# EAGLE design Stick (EAGLE 7.1.0)
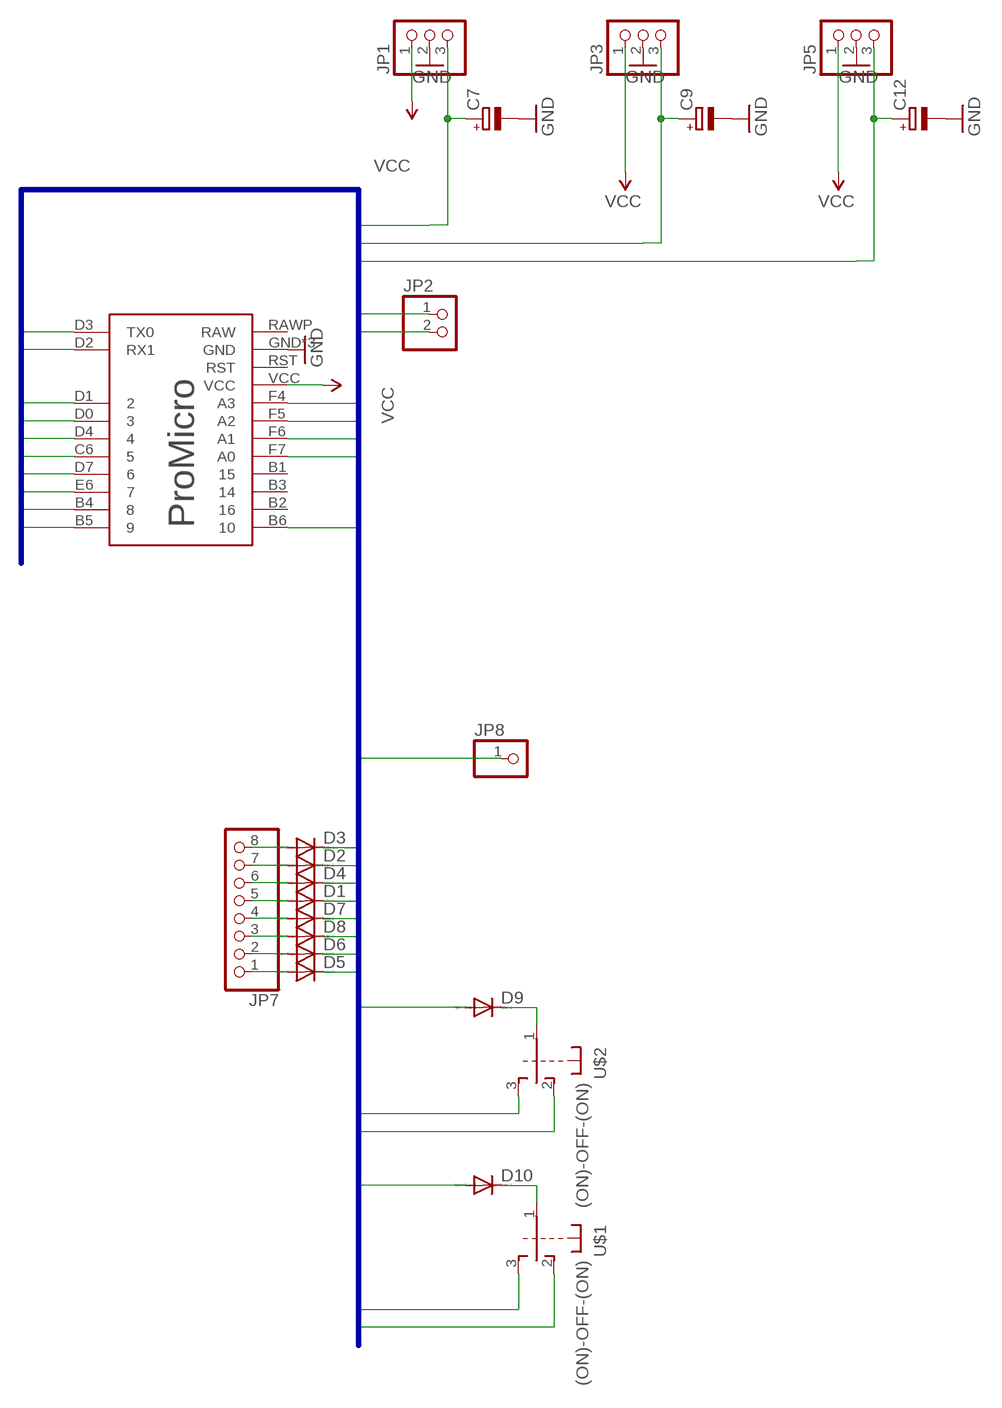
[diagram p0: schematic, sheet 1]

## Parts
C7  CPOL-EUE2.5-5  [E2,5-5]
C9  CPOL-EUE2.5-5  [E2,5-5]
C12  CPOL-EUE2.5-5  [E2,5-5]
D1  DIODE-MINIMELF  [MINIMELF]
D2  DIODE-MINIMELF  [MINIMELF]
D3  DIODE-MINIMELF  [MINIMELF]
D4  DIODE-MINIMELF  [MINIMELF]
D5  DIODE-MINIMELF  [MINIMELF]
D6  DIODE-MINIMELF  [MINIMELF]
D7  DIODE-MINIMELF  [MINIMELF]
D8  DIODE-MINIMELF  [MINIMELF]
D9  DIODE-MINIMELF  [MINIMELF]
D10  DIODE-MINIMELF  [MINIMELF]
JP1  PINHD-1X3  [1X03]
JP2  PINHD-1X2  [1X02]
JP3  PINHD-1X3  [1X03]
JP5  PINHD-1X3  [1X03]
JP7  PINHD-1X8  [1X08]
JP8  PINHD-1X1  [1X01]
U$1  (ON)-OFF-(ON)  [SWITCH-(ON)-OFF-(ON)]
U$2  (ON)-OFF-(ON)  [SWITCH-(ON)-OFF-(ON)]
U$3  SPARKFUN  [PRO-MICRO]

## Nets
A1: C7.+ JP1.3 U$3.F4(A3)
A2: C9.+ JP3.3 U$3.F5(A2)
A3: C12.+ JP5.3 U$3.F6(A1)
A4: JP2.1 U$3.F7(A0)
A5: JP2.2 U$3.B6
C1: JP8.1 U$3.D2(RX1)
C2: D9.A D10.A U$3.D3(TX0)
GND [vcc]: C7.- C9.- C12.- JP1.2 JP3.2 JP5.2 U$3.GND U$3.GND3(GND) U$3.GND4(GND)
N$13: D9.C U$2.1
N$14: D10.C U$1.1
N$21: D8.A JP7.3
N$22: D7.A JP7.4
N$23: D6.A JP7.2
N$24: D5.A JP7.1
N$25: D4.A JP7.6
N$26: D3.A JP7.8
N$27: D2.A JP7.7
N$28: D1.A JP7.5
R1: D5.C U$3.D1
R2: D6.C U$2.2 U$3.D0
R3: D8.C U$2.3 U$3.D4
R4: D7.C U$1.2 U$3.C6
R5: D1.C U$1.3 U$3.D7
R6: D4.C U$3.E6
R7: D2.C U$3.B4
R8: D3.C U$3.B5
VCC: JP1.1 JP3.1 JP5.1 U$3.VCC
Unconnected: U$3.B1 U$3.B2 U$3.B3 U$3.RAWP(RAW) U$3.RST

## Buses
R1,R2,R3,R4,R5,R6,R7,R8,C1,C2,A1,A2,A3,A4,A5

## Library data of the parts
C7 C9 C12 = rcl:CPOL-EU: POLARIZED CAPACITOR, European symbol
D1-D10 = diode:DIODE-: DIODE
JP1 JP3 JP5 = pinhead:PINHD-1X3: PIN HEADER
JP2 = pinhead:PINHD-1X2: PIN HEADER
JP7 = pinhead:PINHD-1X8: PIN HEADER
JP8 = pinhead:PINHD-1X1: PIN HEADER
U$1 U$2 = Namenlos:(ON)-OFF-(ON)
U$3 = SparkFun:SPARKFUN

## Net classes
0 default: width 0.203 mm

## Board
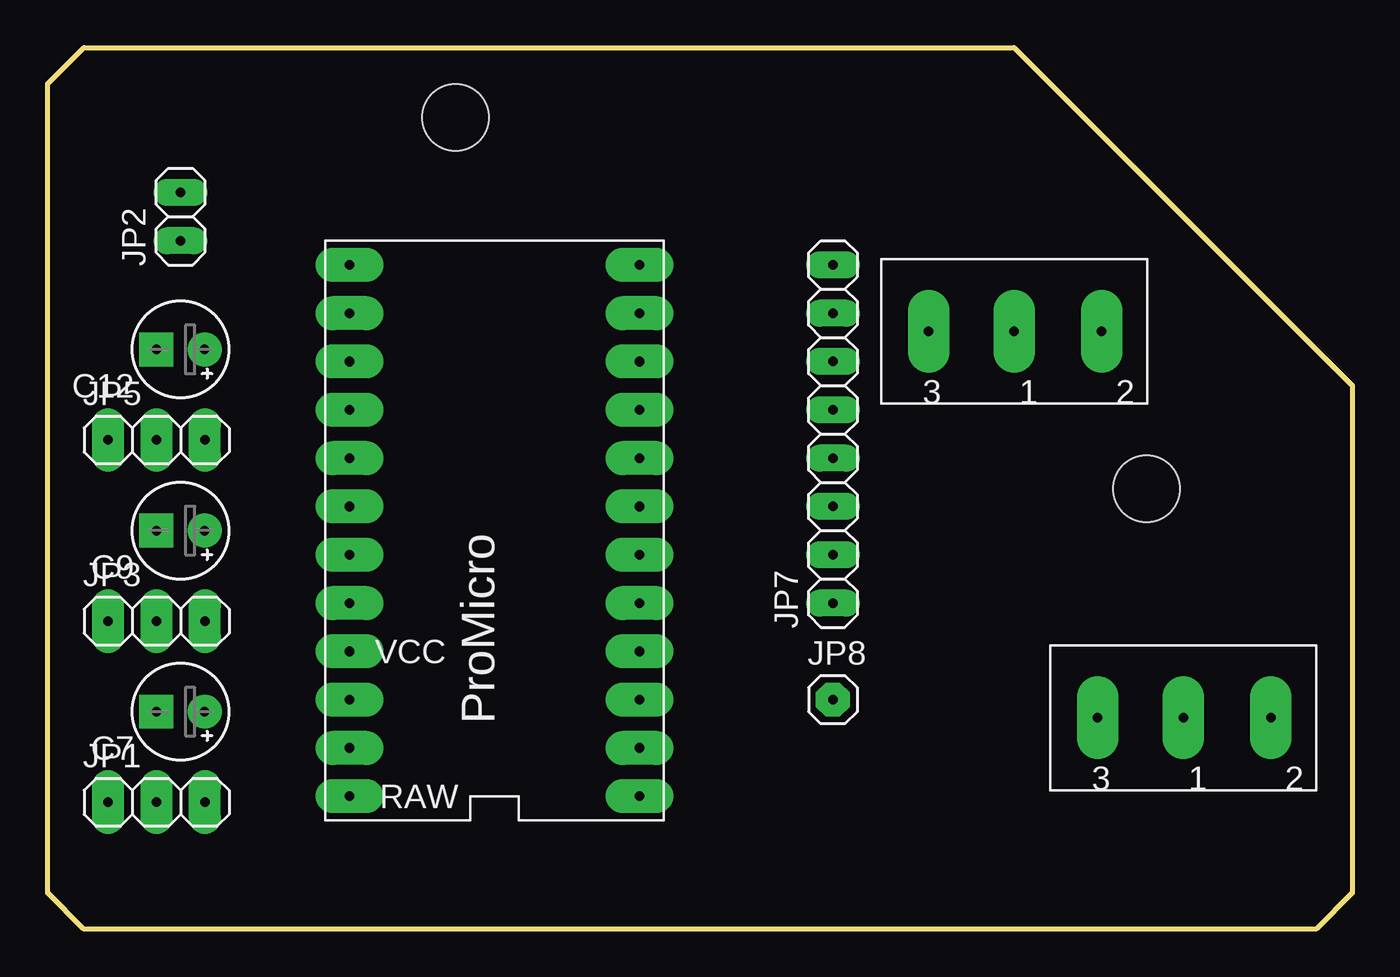
[diagram p1: board, top side]
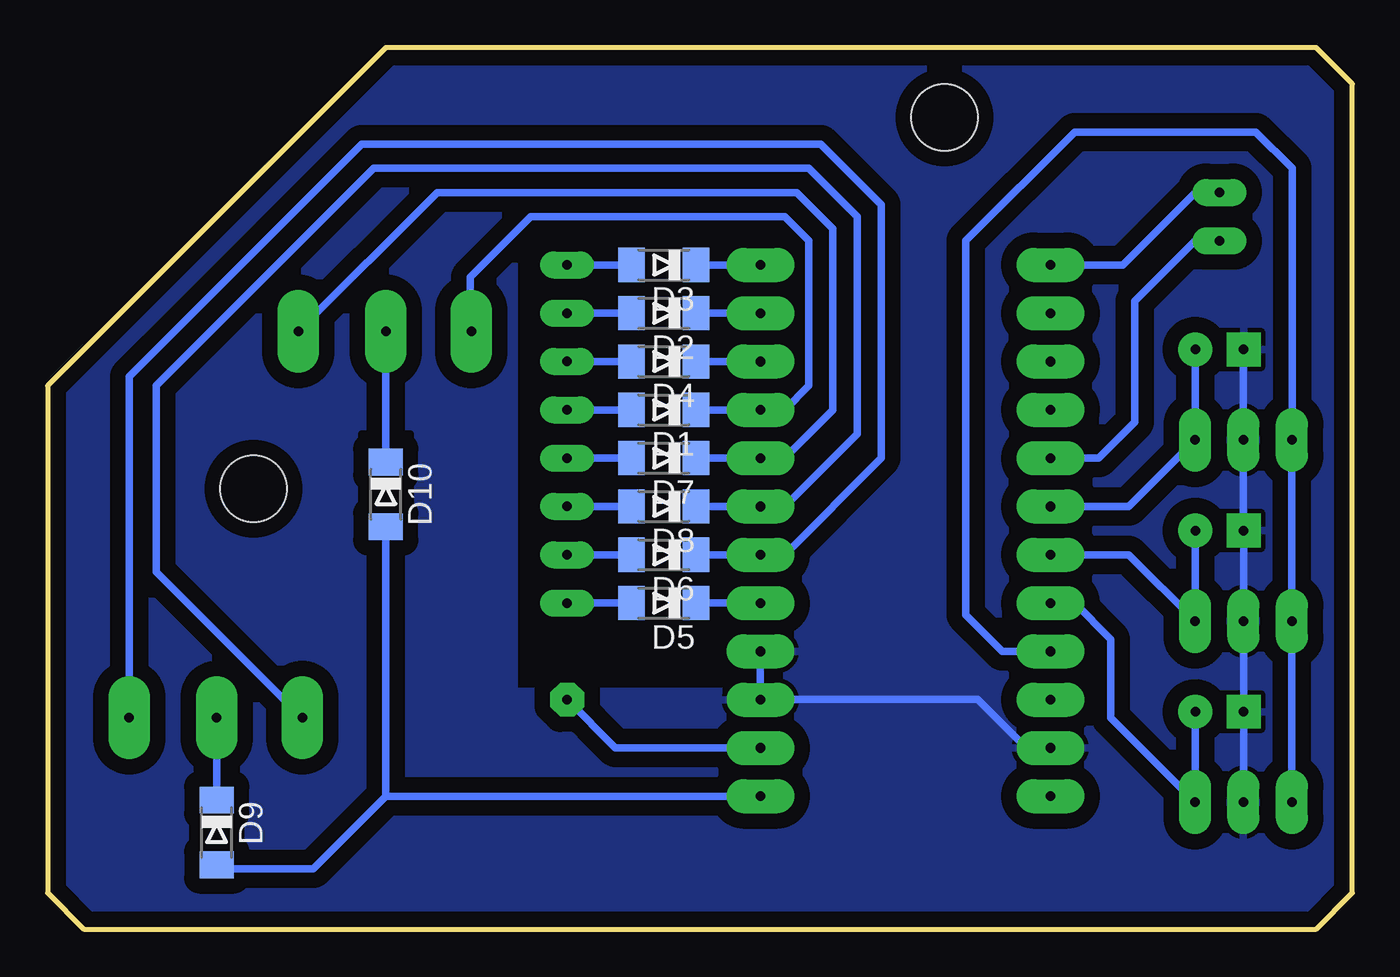
[diagram p2: board, bottom side, seen from below]

Size 68.58 x 46.35 mm. Coordinates in mm from the lower left corner, seen from the top.
Outline: 0,44.45 1.91,46.35 50.8,46.35 68.58,28.57 68.58,1.9 66.67,0 1.91,0 0,1.9 0,44.45
Copper layers (1*16): Top 0.035mm / dielectric 1.5mm / Bottom 0.035mm
Design rules "SparkFun *": minimum track width 8mil, minimum drill 15mil, track to track 7mil, track to pad 7mil, pad to pad 7mil, via to via 7mil, smd to smd 7mil, copper to edge 7mil, drill to drill 7mil, minimum pad ring 12mil, minimum via ring 10mil, stop-mask expansion 4mil, vias tented up to drill 20mil, thermal gap 10mil
Holes 3.5 mm at 57.75,23.16 21.45,42.69
tRestrict: area -22.6,8.3 to -22.4,8.4; area -18.7,12.3 to -18.6,12.4; area -26.3,9 to -19.2,16.3

### Footprints (pad centres in the part's own frame; a part is rotated, then mirrored left to right if it is on the bottom)
E2,5-5 = drill 0.5 pad 1.778: + -1.27,0 | drill 0.5 pad 1.778 square: - 1.27,0
MINIMELF = smd 1.4 x 1.8: A 1.7,0; C -1.7,0
1X03 = drill 0.5 pad 1.676 long: 1 -2.54,0; 2 0,0; 3 2.54,0
1X02 = drill 0.5 pad 1.422 long: 1 -1.27,0; 2 1.27,0
1X08 = drill 0.5 pad 1.422 long: 1 -8.89,0; 2 -6.35,0; 3 -3.81,0; 4 -1.27,0; 5 1.27,0; 6 3.81,0; 7 6.35,0; 8 8.89,0
1X01 = drill 0.5 pad 1.778 octagon: 1 0,0
SWITCH-(ON)-OFF-(ON) = drill 0.5 pad 2.184 long: 1 0,0; 2 -4.6,0; 3 4.5,0
PRO-MICRO = drill 0.508 pad 1.778 long: B1 7.62,7.62; B2 12.7,7.62; B3 10.16,7.62; B4 12.7,-7.62; B5 15.24,-7.62; B6 15.24,7.62; C6 5.08,-7.62; D0 0,-7.62; D1 -2.54,-7.62; D2 -10.16,-7.62; D3 -12.7,-7.62; D4 2.54,-7.62; D7 7.62,-7.62; E6 10.16,-7.62; F4 -2.54,7.62; F5 0,7.62; F6 2.54,7.62; F7 5.08,7.62; GND -10.16,7.62; GND3 -7.62,-7.62; GND4 -5.08,-7.62; RAWP -12.7,7.62; RST -7.62,7.62; VCC -5.08,7.62

### Placement (x,y rotation side)
C7  6.98,11.43 180 top
C9  6.98,20.96 180 top
C12  6.98,30.48 180 top
D1  36.19,27.3 180 bottom
D2  36.19,32.38 180 bottom
D3  36.19,34.92 180 bottom
D4  36.19,29.84 180 bottom
D5  36.19,17.14 180 bottom
D6  36.19,19.68 180 bottom
D7  36.19,24.77 180 bottom
D8  36.19,22.23 180 bottom
D9  59.69,5.08 270 bottom
D10  50.8,22.86 270 bottom
JP1  5.73,6.67 0 top
JP2  6.98,37.46 90 top
JP3  5.73,16.19 0 top
JP5  5.73,25.72 0 top
JP7  41.28,26.04 90 top
JP8  41.28,12.07 0 top
U$1  50.8,31.43 180 top
U$2  59.69,11.11 180 top
U$3  23.49,19.68 90 top

### Tracks (layer width: path | path; a pad name or v marks a point on that pad's centre or on a via)
A1
  Bottom 0.406: U$3.F4 14.6,17.14 12.7,15.24 12.7,11.1 JP1.3 8.27,11.42 C7.+
A2
  Bottom 0.406: C9.+ 8.26,16.21 JP3.3 11.76,19.68 U$3.F5
A3
  Bottom 0.406: C12.+ 8.26,25.73 JP5.3 11.76,22.23 U$3.F6
A4
  Bottom 0.406: U$3.F7 13.34,24.77 11.43,26.67 11.43,33.02 8.26,36.2 JP2.1
A5
  Bottom 0.406: U$3.B6 12.06,34.92 8.26,38.73 JP2.2
C1
  Bottom 0.406: U$3.D2 38.73,9.53 JP8.1
C2
  Bottom 0.406: 50.8,6.99 54.61,3.18 59.48,3.18 D9.A | D10.A 50.8,6.99 | U$3.D3 50.8,6.99
GND
  Bottom 0.406: U$3.GND4 U$3.GND3 19.69,12.07 17.15,9.53 U$3.GND | JP1.2 5.72,6.68 C7.- 5.72,16.51 5.73,16.5 JP3.2 5.72,16.21 C9.- 5.73,20.97 JP5.2 5.73,30.47 C12.-
  pour Bottom (isolate 0.813): 0.63,45.72 50.17,45.72 67.94,27.94 67.94,0.64 0.63,0.64
N$1
  cutout Bottom (isolate 0.813): 32.39,36.83 32.39,12.7 43.81,12.7 43.81,36.83
N$2
  cutout Bottom (isolate 0.813): 49.53,26.04 49.53,20.32 52.07,20.32 52.07,26.04
N$4
  cutout Bottom (isolate 0.813): 58.42,6.99 58.42,3.18 60.96,3.18 60.96,6.99
N$13
  Bottom 0.406: D9.C U$2.1
N$14
  Bottom 0.406: D10.C 50.8,28.26 U$1.1
N$21
  Bottom 0.406: D8.A JP7.3
N$22
  Bottom 0.406: D7.A JP7.4
N$23
  Bottom 0.406: D6.A JP7.2
N$24
  Bottom 0.406: D5.A JP7.1
N$25
  Bottom 0.406: D4.A JP7.6
N$26
  Bottom 0.406: D3.A JP7.8
N$27
  Bottom 0.406: D2.A JP7.7
N$28
  Bottom 0.406: D1.A JP7.5
R1
  Bottom 0.406: U$3.D1 D5.C
R2
  Bottom 0.406: U$2.2 64.29,29.05 52.07,41.27 27.94,41.27 24.77,38.1 24.77,24.77 29.84,19.68 U$3.D0 D6.C
R3
  Bottom 0.406: U$2.3 62.86,18.79 62.86,28.57 51.44,40 28.58,40 26.03,37.46 26.03,26.04 29.84,22.23 U$3.D4 D8.C
R4
  Bottom 0.406: U$1.2 48.1,38.73 29.21,38.73 27.3,36.83 27.3,27.3 29.84,24.77 U$3.C6 D7.C
R5
  Bottom 0.406: U$1.3 46.36,31.49 46.36,34.29 43.18,37.46 29.84,37.46 28.58,36.2 28.58,28.57 29.84,27.3 U$3.D7 D1.C
R6
  Bottom 0.406: U$3.E6 D4.C
R7
  Bottom 0.406: U$3.B4 D2.C
R8
  Bottom 0.406: U$3.B5 D3.C
VCC
  Bottom 0.406: JP1.1 JP3.1 JP5.1 3.17,25.73 3.17,40 5.08,41.91 14.6,41.91 20.32,36.2 20.32,16.51 18.41,14.61 U$3.VCC